# Altium schematic sheet SCH_01_Power.SchDoc
size A4; SheetNumber: 5; SheetTotal: 9; SPICEModelCacheLAVQIBOV: <root> / <DocumentId>LAVQIBOV</DocumentId> / <CacheFrame Number="0"> / <Model Name="865080340003_22uf" Kind="CKT"> / <Text>******* / .subckt 865080340003_22uF 1 2 / Rser 1 3 1.48 / Lser 2 4 0.000000000971804 / C1 3 4 0.000022 / Rpar 3 4 4545454.54545455 / .ends 865080340003_22uF</Text> / </Model> / <Model Name="4532_784773147_47u" Kind="CKT"> / <Text>******* / .subckt 4532_784773147_47u 1 2 / Rp 1 2 74067 / Cp 1 2 2.231p / Rs 1 N3 0.523 / L1 N3 2 40.081u / .ends 4532_784773147_47u</Text> / </Model> / <Model Name="865080245009_220uf" Kind="CKT"> / <Text>******* / .subckt 865080245009_220uF 1 2 / Rser 1 3 0.244 / Lser 2 4 4.56031232986069E-09 / C1 3 4 0.00022 / Rpar 3 4 454545.454545455 / .ends 865080245009_220uF</Text> / </Model> / <Model Name="0603_885012206095_100nf" Kind="CKT"> / <Text>******* / .subckt 0603_885012206095_100nF 1 2 / Rser 1 3 0.0157659152881 / Lser 2 4 3.10171966E-10 / C1 3 4 0.0000001 / Rpar 3 4 5000000000 / .ends 0603_885012206095_100nF</Text> / </Model> / <Model Name="0603_885012106031_10uf" Kind="CKT"> / <Text>******* / .subckt 0603_885012106031_10uF 1 2 / Rser 1 3 0.0105 / Lser 2 4 0.0000000008 / C1 3 4 0.00001 / Rpar 3 4 10000000 / .ends 0603_885012106031_10uF</Text> / </Model> / </CacheFrame> / </root>
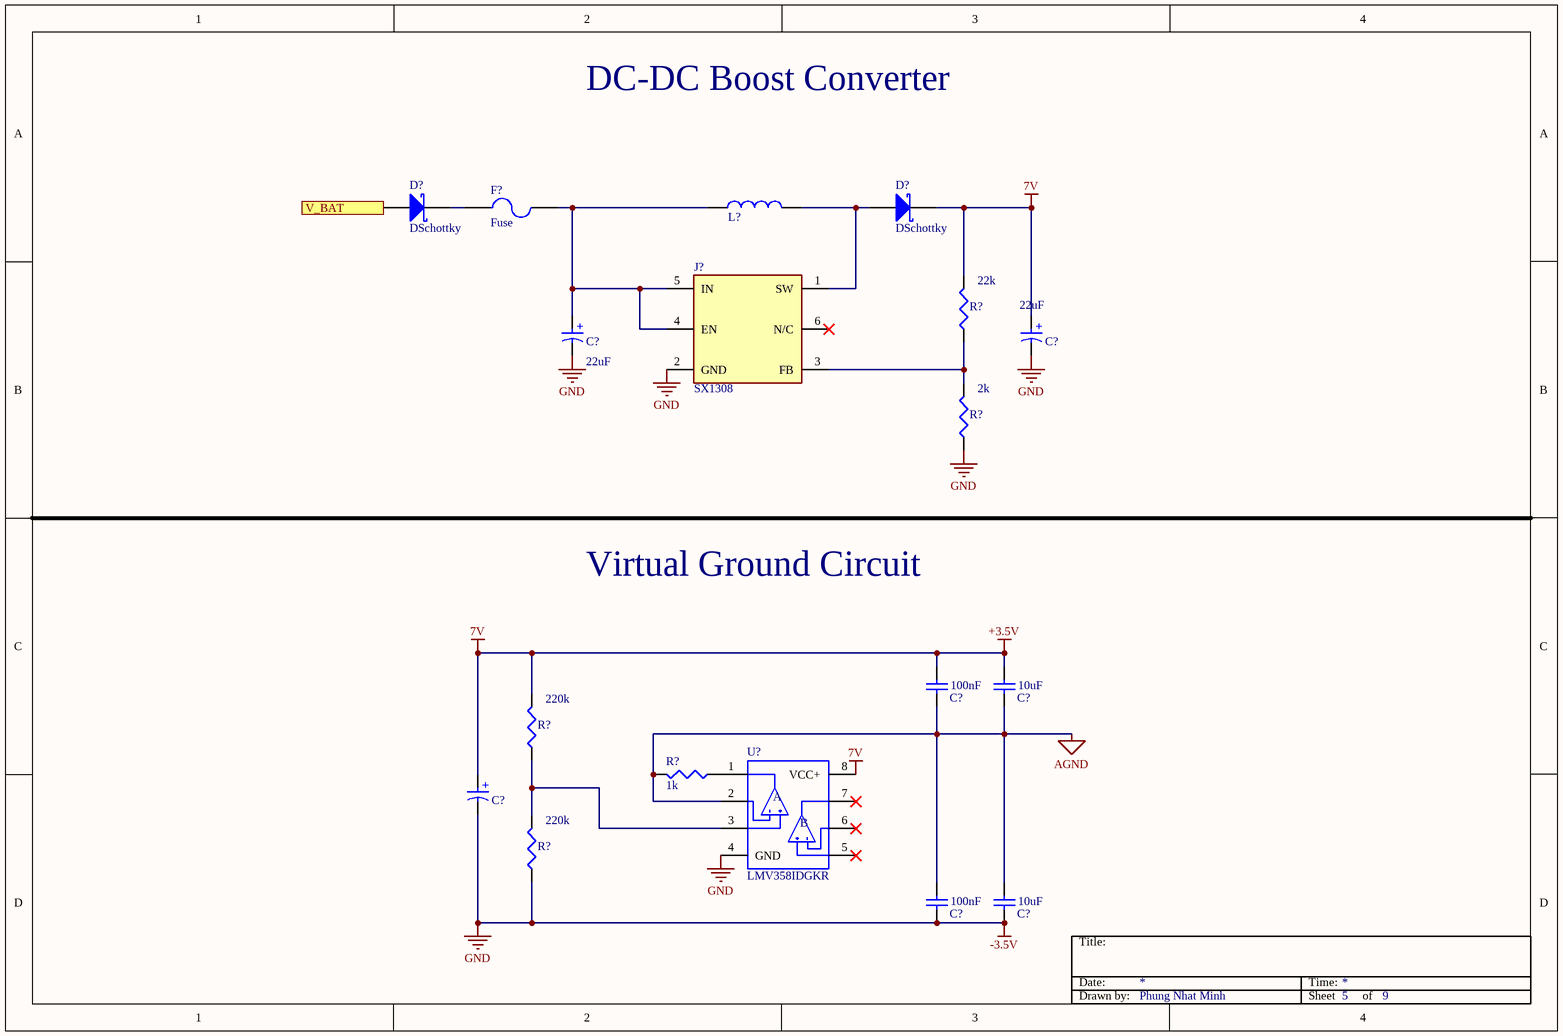
[diagram p0: SCH_01_Power.SchDoc]

## Parts
(Parts that share a designator on the sheet are numbered #1, #2 ... from top to bottom, then left to right.)
C?#1  22uF  [WCAP-ASLI_D4H5.5]
C?#2  22uF  [WCAP-ASLI_D4H5.5]
C?#3  100nF  [WCAP-CSGP_0603_L1.6W0.8H0.8_Reflow]
C?#4  10uF  [WCAP-CSGP_0603_L1.6W0.8H0.8_Reflow]
C?#5  220uF  [WCAP-ASLI_D6.3H7.7]  (value not drawn)
C?#6  100nF  [WCAP-CSGP_0603_L1.6W0.8H0.8_Reflow]
C?#7  10uF  [WCAP-CSGP_0603_L1.6W0.8H0.8_Reflow]
D?#1  DSchottky  [PCBComponent_1]
D?#2  DSchottky  [PCBComponent_1]
F?  Fuse  [PCBComponent_1]
J?  SX1308  [SOT-23-6]
L?  47µH  [WE-PD2A_4532]  (value not drawn)
R?#1  22k  [WRIS-PSMB_0603_L1.6W0.8H0.35]
R?#2  2k  [WRIS-PSMB_0603_L1.6W0.8H0.35]
R?#3  220k  [WRIS-PSMB_0603_L1.6W0.8H0.35]
R?#4  1k  [WRIS-PSMB_0603_L1.6W0.8H0.35]
R?#5  220k  [WRIS-PSMB_0603_L1.6W0.8H0.35]
U?  LMV358IDGKR  [SOP65P490X110-8N]

## Ports
V_BAT (in, see Schematic_Top[2C])

## Nets
+3.5V: C?#2.1(P) C?#3.2 C?#4.2 C?#5.1(P) D?#2.2(K) R?#1.2 R?#3.2 U?.8(VCC+)  [also labelled 7V]
-3.5V: C?#1.2(N) C?#2.2(N) C?#5.2(N) C?#6.1 C?#7.1 J?.2(GND) R?#2.1 R?#5.1 U?.4(GND)  [also labelled GND]
AGND: C?#3.1 C?#4.1 C?#6.2 C?#7.2 R?#4.2 U?.2(1IN-)
V_BAT: D?#1.1(A) ; port V_BAT
NetC?#1_1: C?#1.1(P) F?.2 J?.4(EN) J?.5(IN) L?.1
NetD?#1_2: D?#1.2(K) F?.1
NetD?#2_1: D?#2.1(A) J?.1(SW) L?.2
NetJ?_3: J?.3(FB) R?#1.1 R?#2.2
NetR?#3_1: R?#3.1 R?#5.2 U?.3(1IN+)
NetR?#4_1: R?#4.1 U?.1(1OUT)

Not connected (* = marked no-connect by the designer): J? 6(N/C)*; U? 5(2IN+)* 6(2IN-)* 7(2OUT)*

## Notes on the sheet
- DC-DC Boost Converter
- Virtual Ground Circuit
- Title:
- Date:
- Time:
- Drawn by:
- Phung Nhat Minh
- Sheet
- of
- (in symbol 865080245009) +
- (in symbol 865080340003) +
- (in symbol LMV358IDGKR) A; B

## Library data of the parts
C?#1 C?#2 = 865080340003: WCAP-ASLI Aluminum Electrolytic Capacitor, V-Chip, D4 x H5.5mm, 22uF, 16V; Manufacturer: Wurth Elektronik; Capacitance Tolerance: +/-20%; Dissipation Factor: 16%; Endurance: 2000h; Leakage Current: 3.52uA; Ripple Current: 90mA; Technical Reference: ASEB055220M016DVCTAB000; Manufacturer Part Number: 865080340003; Category: Aluminum Electrolytic Capacitors; Match Code: WCAP-ASLI; ComponentLink1Description: Website Link; ComponentLink1URL: https://www.we-online.com/redexpert/article/865080340003?ad; ComponentLink2Description: Datasheet Link; ComponentLink2URL: https://www.we-online.com/redexpert/spec/865080340003?ad; Mount: Surface Mount; Operating Temperature Max: 105°C; Operating Temperature Min: -55°C; Packaging: Tape and Reel; Height: 5.5mm; Diameter: 4mm; Capacitance: 22uF; Rated Voltage (DC): 16V
C?#3 C?#6 = 885012206095: WCAP-CSGP Multilayer Ceramic Chip Capacitor, General Purpose, size 0603, X7R, 100nF, 50VDC; Manufacturer: Wurth Elektronik; Case/Size Code: 0603; Capacitance Tolerance: +/-10%; Dissipation Factor: 3%; Insulation Resistance: 5GOhm; Rated Voltage (DC): 50V; Technical Reference: X7R0603104K050DFCT10000; Manufacturer Part Number: 885012206095; Category: Multilayer Ceramic Chip Capacitors; Match Code: WCAP-CSGP; ComponentLink1Description: Website Link; ComponentLink1URL: https://www.we-online.com/redexpert/article/885012206095?ad; ComponentLink2Description: Datasheet Link; ComponentLink2URL: https://www.we-online.com/redexpert/spec/885012206095?ad; Mount: Surface Mount; Operating Temperature Max: 125°C; Operating Temperature Min: -55°C; Packaging: Tape and Reel; Length: 1.6mm; Width: 0.8mm; Height: 0.8mm; Capacitance: 100nF; Ceramic Type: X7R
C?#4 C?#7 = 885012106031: WCAP-CSGP Multilayer Ceramic Chip Capacitor, General Purpose, size 0603, X5R, 10uF, 25VDC; Manufacturer: Wurth Elektronik; Case/Size Code: 0603; Capacitance Tolerance: +/20%; Dissipation Factor: 20%; Insulation Resistance: 0.01GOhm; Rated Voltage (DC): 25V; Technical Reference: X5R0603106M025DFCT10000; Manufacturer Part Number: 885012106031; Category: Multilayer Ceramic Chip Capacitors; Match Code: WCAP-CSGP; ComponentLink1Description: Website Link; ComponentLink1URL: https://www.we-online.com/redexpert/article/885012106031?ad; ComponentLink2Description: Datasheet Link; ComponentLink2URL: https://www.we-online.com/redexpert/spec/885012106031?ad; Mount: Surface Mount; Operating Temperature Max: 85°C; Operating Temperature Min: -55°C; Packaging: Tape and Reel; Length: 1.6mm; Width: 0.8mm; Height: 0.8mm; Capacitance: 10uF; Ceramic Type: X5R
C?#5 = 865080245009: WCAP-ASLI Aluminum Electrolytic Capacitor, V-Chip, D6.3 x H7.7mm, 220uF, 10V; Manufacturer: Wurth Elektronik; Capacitance Tolerance: +/-20%; Dissipation Factor: 19%; Endurance: 2000h; Leakage Current: 22uA; Ripple Current: 270mA; Technical Reference: ASED077221M010DVCTCB000; Manufacturer Part Number: 865080245009; Category: Aluminum Electrolytic Capacitors; Match Code: WCAP-ASLI; ComponentLink1Description: Website Link; ComponentLink1URL: https://www.we-online.com/redexpert/article/865080245009?ad; ComponentLink2Description: Datasheet Link; ComponentLink2URL: https://www.we-online.com/redexpert/spec/865080245009?ad; Mount: Surface Mount; Operating Temperature Max: 105°C; Operating Temperature Min: -55°C; Packaging: Tape and Reel; Height: 7.7mm; Diameter: 6.3mm; Capacitance: 220uF; Rated Voltage (DC): 10V
J? = SX1308: SX1308 - Transceiver; LoRaÂ® Evaluation Board; MF: Semtech Corporation; Price: None; Purchase-URL: https://pricing.snapeda.com/search/part/SX1308/?ref=eda; Check_prices: https://www.snapeda.com/parts/SX1308/Semtech+Corporation/view-part/?ref=eda; Value: *; SnapEDA_Link: https://www.snapeda.com/parts/SX1308/Semtech+Corporation/view-part/?ref=snap; Availability: In Stock; MP: SX1308; Package: - Semtech Corporation
L? = 784773147: WE-PD2A SMT Power Inductor, size 4532, 47µH, 0.68A, 0.844Ω; Manufacturer: Wurth Elektronik; Case/Size Code: 4532; DC Resistance: 0.523Ω; Rated Voltage: 80VDC; Saturation Current: 0.77A; Self Resonant Frequency: 12MHz; Manufacturer Part Number: 784773147; Category: Single Coil Power Inductors; Match Code: WE-PD2A; ComponentLink1Description: Website Link; ComponentLink1URL: https://www.we-online.com/redexpert/article/784773147?ad; ComponentLink2Description: Datasheet Link; ComponentLink2URL: https://www.we-online.com/redexpert/spec/784773147?ad; Mount: Surface Mount; Operating Temperature Max: 125°C; Operating Temperature Min: -40°C; Packaging: Tape and Reel; Length: 4.5mm; Width: 4mm; Height: 3.2mm; Automotive: Yes; DC Resistance Max: 0.844Ω; Inductance: 47µH; Rated Current: 0.68A
R?#1-R?#5 = 580060716001: WRIS-PSMB Metal Plate Resistor, SMT, size 0603, 0.33W, 5mΩ, +/-1%; Manufacturer: Wurth Elektronik; Case/Size Code: 0603; Rated Current: 8.12A; Technical Reference: MB0603R005F103KAATP0000; Temperature Coefficient of Resistance: +/-100ppm/°C; Manufacturer Part Number: 580060716001; Category: Metal Plate Resistors; Match Code: WRIS-PSMB; ComponentLink1Description: Website Link; ComponentLink1URL: https://www.we-online.com/redexpert/article/580060716001?ad; ComponentLink2Description: Datasheet Link; ComponentLink2URL: https://www.we-online.com/redexpert/spec/580060716001?ad; Mount: Surface Mount; Operating Temperature Max: 155°C; Operating Temperature Min: -55°C; Packaging: Tape and Reel; Length: 1.6mm; Width: 0.8mm; Height: 0.35mm; Rated Power: 0.33W; Resistance: 5mΩ; Resistance Tolerance: +/-1%
U? = LMV358IDGKR: Dual Low-Voltage Rail-to-Rail Output Operational Amplifier - see LMV358A for upgraded version 8-VSSOP -40 to 125; MF: Texas Instruments; MP: LMV358IDGKR; Texas_Instruments-Purchase-URL: https://snapeda.com/shop?store=Texas+Instruments&id=105778; SnapEDA_Link: https://www.snapeda.com/parts/LMV358IDGKR/Texas%20Instruments/view-part/105778/?ref=snap; Availability: Good; Mouser-Purchase-URL: https://snapeda.com/shop?store=Mouser&id=105778; DigiKey-Purchase-URL: https://snapeda.com/shop?store=DigiKey&id=105778; Arrow_Electronics-Purchase-URL: https://snapeda.com/shop?store=Arrow+Electronics&id=105778; Value: *; Package: VSSOP-8 Texas Instruments; Price: None